# EAGLE design MiniBoard (EAGLE 9.6.2)
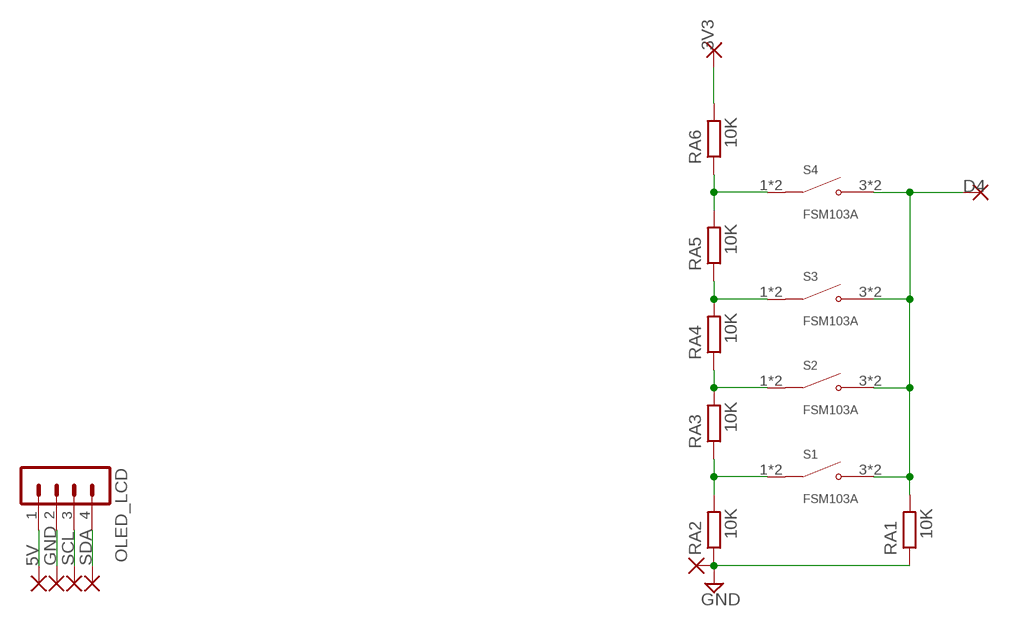
[diagram p0: schematic, sheet 1]

## Parts
OLED_LCD  MA04-1  [MA04-1]
PAD1  WIREPAD1,6/0,9  [1,6/0,9]
PAD25  WIREPAD1,6/0,9  [1,6/0,9]
PAD26  WIREPAD1,6/0,9  [1,6/0,9]
PAD52  WIREPAD1,6/0,9  [1,6/0,9]
PAD78  WIREPAD1,6/0,9  [1,6/0,9]
PAD103  WIREPAD1,6/0,9  [1,6/0,9]
PAD104  WIREPAD1,6/0,9  [1,6/0,9]
RA1  10K  R-EU_0309/12  [0309/12]
RA2  10K  R-EU_0309/12  [0309/12]
RA3  10K  R-EU_0309/12  [0309/12]
RA4  10K  R-EU_0309/12  [0309/12]
RA5  10K  R-EU_0309/12  [0309/12]
RA6  10K  R-EU_0309/12  [0309/12]
S1  FSM103A  [SW_1571627-1]
S2  FSM103A  [SW_1571627-1]
S3  FSM103A  [SW_1571627-1]
S4  FSM103A  [SW_1571627-1]

## Nets
3V3: PAD104.1(P) RA6.2
5V: OLED_LCD.1 PAD25.1(P)
D4: PAD103.1(P) RA1.2 S1.3(NO) S1.4(NO) S2.3(NO) S2.4(NO) S3.3(NO) S3.4(NO) S4.3(NO) S4.4(NO)
GND: OLED_LCD.2 PAD1.1(P) PAD26.1(P) RA1.1 RA2.1
N$5: RA4.2 RA5.1 S3.1(COM) S3.2(COM)
N$8: RA3.2 RA4.1 S2.1(COM) S2.2(COM)
N$9: RA2.2 RA3.1 S1.1(COM) S1.2(COM)
N$32: RA5.2 RA6.1 S4.1(COM) S4.2(COM)
SCL: OLED_LCD.3 PAD52.1(P)
SDA: OLED_LCD.4 PAD78.1(P)

## Library data of the parts
OLED_LCD = con-lstb:MA04-1: PIN HEADER; OC_FARNELL: unknown; OC_NEWARK: unknown
PAD1 PAD25 PAD26 PAD52 PAD78 PAD103 PAD104 = wirepad-ws:WIREPAD: Wire PAD connect wire on PCB
RA1-RA6 = rcl-ws:R-EU_: RESISTOR, European symbol; SPICEPREFIX: R
S1-S4 = FSM103A:FSM103A: Alcoswitch FSM100-104, Tactile Switches, Round Actuator Style, Operating Function NO, Brass Contact Base Material Check availability <https://pricing.snapeda.com/parts/FSM103A/TE%20Connectivity/view-part?ref=eda>; AVAILABILITY: In Stock; CHECK_PRICES: https://www.snapeda.com/parts/FSM103A/TE+Connectivity+ALCOSWITCH+Switches/view-part/?ref=eda; COMMENT: 1571627-1; DESCRIPTION: Alcoswitch, Tactile switch,PCB,SPST,red actuator | TE Connectivity FSM103A; MF: TE Connectivity; MP: FSM103A; PACKAGE: None; PRICE: None; SNAPEDA_LINK: https://www.snapeda.com/parts/FSM103A/TE+Connectivity+ALCOSWITCH+Switches/view-part/?ref=snap

## Board
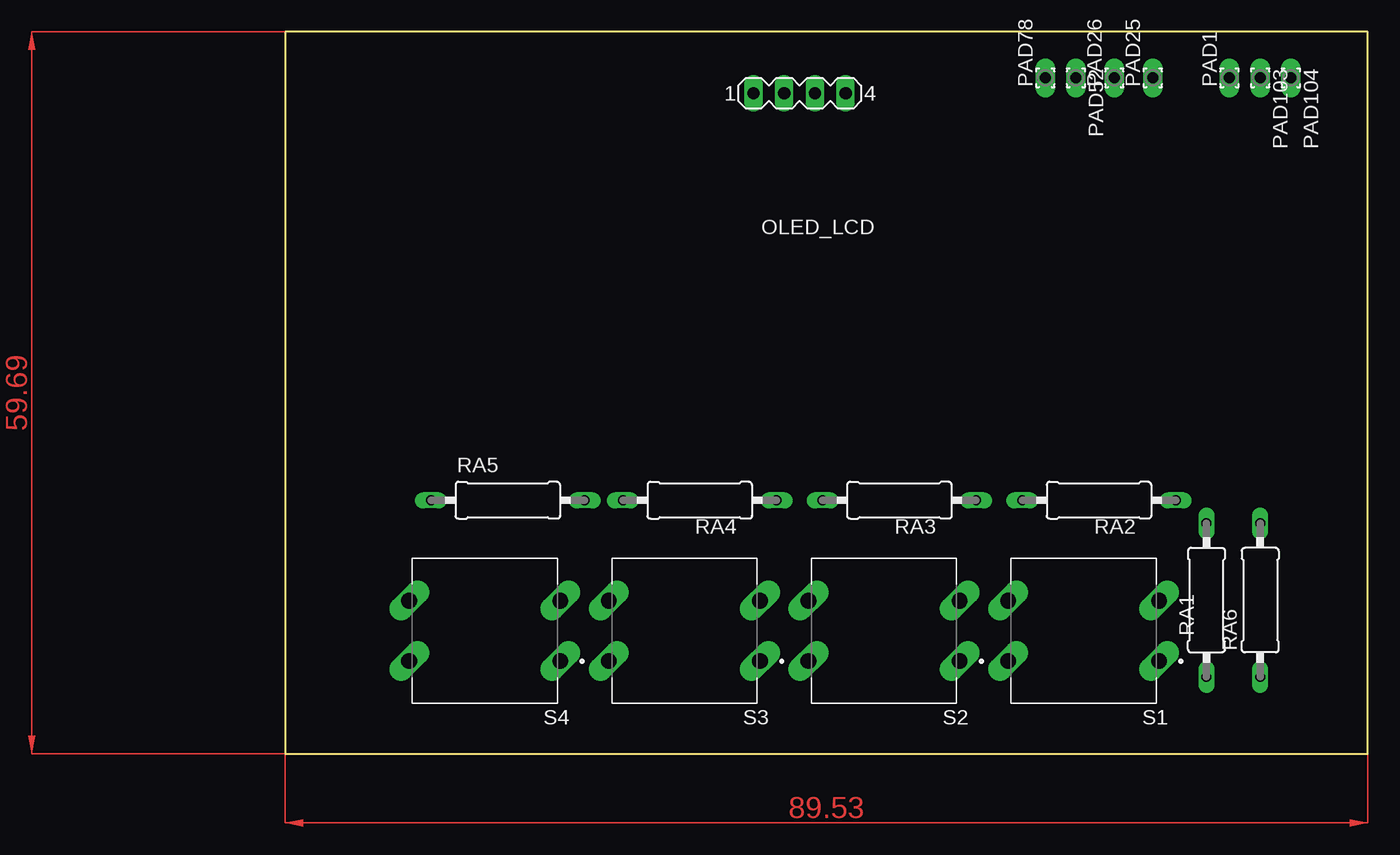
[diagram p1: board, top side]
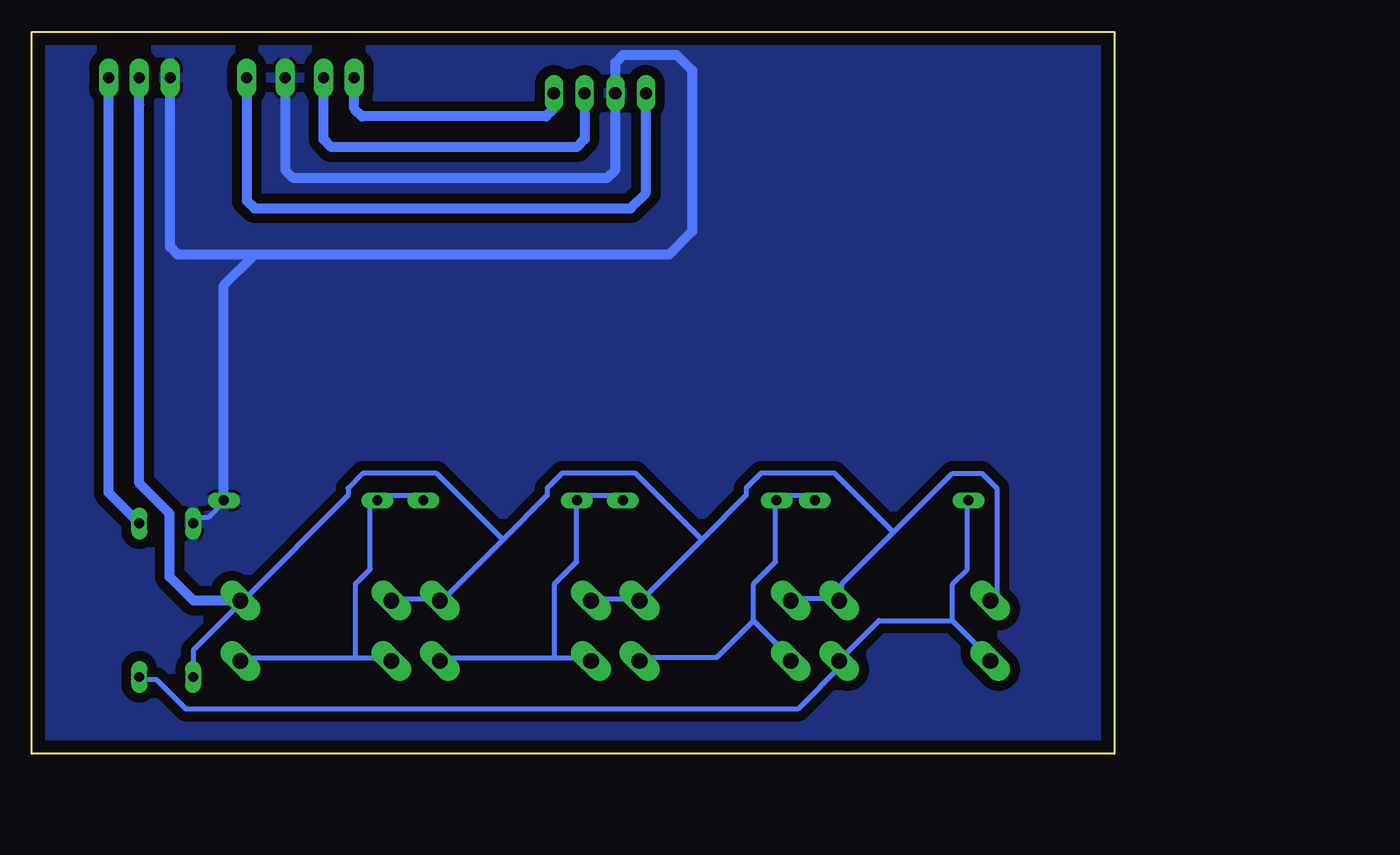
[diagram p2: board, bottom side, seen from below]

Size 89.53 x 59.69 mm. Coordinates in mm from the lower left corner, seen from the top.
Outline: 0,0 89.53,0 89.53,59.69 0,59.69 0,0
Copper layers (1*16): Top 0.035mm / dielectric 1.5mm / Bottom 0.035mm
Design rules "default *": minimum track width 16mil, minimum drill 0.35mm, track to track 32mil, track to pad 32mil, pad to pad 32mil, via to via 32mil, smd to smd 6mil, copper to edge 40mil, drill to drill 6mil, minimum pad ring 10mil, minimum via ring 8mil, stop-mask expansion 4mil, vias tented up to drill 0mil, thermal gap 10mil

### Footprints (pad centres in the part's own frame; a part is rotated, then mirrored left to right if it is on the bottom)
MA04-1 = drill 1.016 long: 1 -3.81,0; 2 -1.27,0; 3 1.27,0; 4 3.81,0
1,6/0,9 = drill 0.914 pad 1.6 long: 1 0,0
0309/12 = drill 0.813 long: 1 -6.35,0; 2 6.35,0
SW_1571627-1 = drill 1.3 long: 1 -6.25,2.5; 2 6.25,2.5; 3 -6.25,-2.5; 4 6.25,-2.5

### Placement (x,y rotation side)
OLED_LCD  42.55,54.61 0 top
PAD1  78.1,55.88 90 top
PAD25  71.75,55.88 90 top
PAD26  68.58,55.88 90 top
PAD52  65.41,55.88 270 top
PAD78  62.87,55.88 90 top
PAD103  80.64,55.88 270 top
PAD104  83.18,55.88 270 top
RA1  76.2,12.7 270 top
RA2  67.31,20.96 180 top
RA3  50.8,20.96 180 top
RA4  34.29,20.96 180 top
RA5  18.41,20.96 180 top
RA6  80.64,12.7 90 top
S1  66.04,10.16 180 top
S2  49.53,10.16 180 top
S3  33.02,10.16 180 top
S4  16.51,10.16 180 top

### Tracks (layer width: path | path; a pad name or v marks a point on that pad's centre or on a via)
3V3
  Bottom 0.813: RA6.2 83.18,21.59 PAD104.1
5V
  Bottom 0.813: PAD25.1 71.75,45.72 71.12,45.09 40.01,45.09 38.73,46.35 OLED_LCD.1
D4
  Bottom 0.406: RA1.2 76.17,6.73 76.17,8.56 72.52,12.22 S1.3 71.91,12.83 63.37,21.36 63.37,21.97 62.15,23.19 56.06,23.19 50.57,17.7 | 80.44,53.67 80.44,55.5 PAD103.1 | S1.4 59.72,12.83 56.06,12.83 S2.3 55.45,12.83 50.57,17.7 | S2.4 43.26,12.83 39.6,12.83 S3.3 38.99,12.83 34.11,17.7 | 18.26,18.31 22.53,14.05 22.53,12.83 S4.3 23.14,12.83 26.19,12.83 S3.4 | 18.26,18.31 13.39,23.19 10.95,23.19 9.73,21.97 9.73,12.83 S4.4 | 34.11,17.7 30.45,21.36 30.45,21.97 29.23,23.19 23.14,23.19 18.26,18.31 | 50.57,17.7 46.91,21.36 46.91,21.97 45.7,23.19 39.6,23.19 34.11,17.7
  Bottom 0.813: S1.3 76.16,12.66 78.13,14.63 78.13,19.85 80.64,22.37 PAD103.1
GND
  Bottom 0.406: RA1.1 76.17,19.53 74.95,19.53 73.74,20.75 RA2.1 73.13,21.36 | 41.43,54.46 OLED_LCD.2
  Bottom 0.813: PAD26.1 68.58,48.26 67.94,47.62 41.91,47.62 41.27,48.26 OLED_LCD.2 41.27,57.15 40.64,57.78 36.2,57.78 34.93,56.52 34.93,43.18 36.83,41.27 71.12,41.27 | 71.12,41.27 77.47,41.27 78.1,41.91 PAD1.1 | RA2.1 73.66,38.73 71.12,41.27
  pour Bottom: 0,59.69 0,0 89.53,0 89.53,59.69
N$5
  Bottom 0.406: RA5.1 24.97,21.36 27.41,21.36 RA4.2 28.02,20.75 28.02,15.88 29.84,14.05 29.84,11 | 29.84,11 26.8,7.95 S3.2 | 29.84,11 32.89,7.95 38.99,7.95 S3.1
N$8
  Bottom 0.406: RA4.1 40.82,21.36 43.87,21.36 RA3.2 44.48,20.75 44.48,15.88 46.3,14.05 46.3,7.95 | 46.3,7.95 55.45,7.95 S2.1 | 46.3,7.95 43.87,7.95 S2.2
N$9
  Bottom 0.406: RA3.1 57.28,21.36 60.94,21.36 RA2.2 61.54,20.75 61.54,15.27 62.76,14.05 62.76,7.95 | 62.76,7.95 71.91,7.95 S1.1 | 62.76,7.95 60.33,7.95 S1.2
N$32
  Bottom 0.406: 13.39,11 13.39,14.05 12.17,15.27 12.17,20.75 RA5.2 | 13.39,11 10.34,7.95 S4.2 | RA6.1 80.44,6.12 79.22,6.12 76.78,3.68 26.19,3.68 22.53,7.34 S4.1 22.53,7.95 19.48,11 13.39,11
SCL
  Bottom 0.813: OLED_LCD.3 43.82,50.8 44.45,50.16 64.77,50.16 65.41,50.8 PAD52.1
SDA
  Bottom 0.813: OLED_LCD.4 46.36,53.34 46.99,52.7 62.23,52.7 62.87,53.34 PAD78.1
(copper drawn outside any net)
  shapes: Top area x2